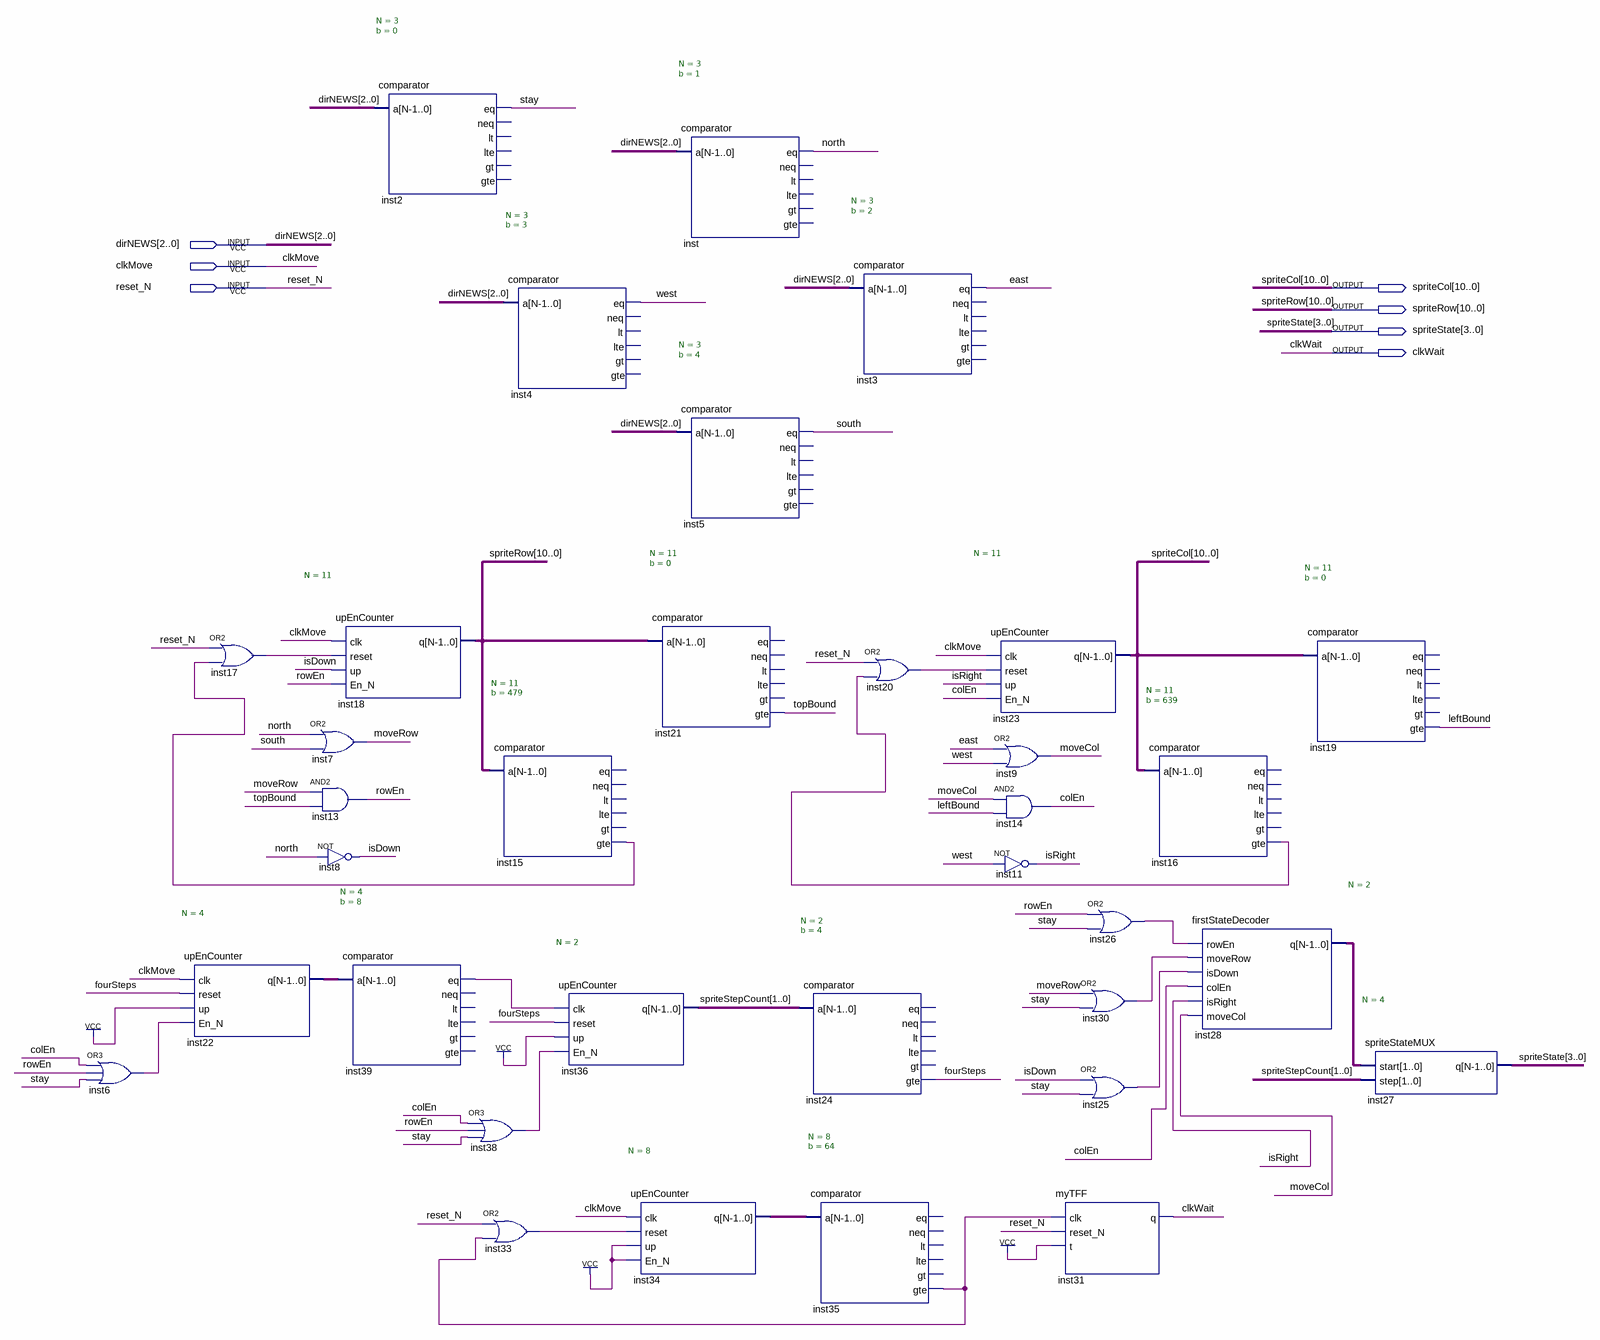
[diagram p0: schematic sheet]
// Quartus schematic spritePositionModule.bdf as structural Verilog: 34 symbols, 7 pins
module spritePositionModule (
  input  [2:0] dirNEWS,
  input  clkMove,
  input  reset_N,
  output [10:0] spriteCol,
  output [10:0] spriteRow,
  output [3:0] spriteState,
  output clkWait
);

  wire colEn, east, fourSteps, inst6_out, inst15_gte, inst16_gte, inst17_out, inst20_out, inst25_out,
       inst26_out, inst30_out, inst33_out, inst35_gte, inst38_out, inst39_eq, isDown, isRight, leftBound,
       moveCol, moveRow, north, rowEn, south, stay, topBound, west;
  wire [1:0] inst28_q, spriteStepCount;
  wire [3:0] inst22_q;
  wire [7:0] inst34_q;

  or inst6 (inst6_out, colEn, rowEn, stay);
  upEnCounter #(.N(4)) inst22 (.clk(clkMove), .reset(fourSteps), .up(1'b1), .En_N(inst6_out), .q(inst22_q));
  or inst17 (inst17_out, reset_N, inst15_gte);
  upEnCounter #(.N(11)) inst18 (.clk(clkMove), .reset(inst17_out), .up(isDown), .En_N(rowEn), .q(spriteRow));
  or inst7 (moveRow, north, south);
  and inst13 (rowEn, moveRow, topBound);
  not inst8 (isDown, north);
  comparator #(.N(4), .b(8)) inst39 (.a(inst22_q), .eq(inst39_eq));  // open: neq, lt, lte, gt, gte
  comparator #(.N(3), .b(0)) inst2 (.a(dirNEWS), .eq(stay));  // open: neq, lt, lte, gt, gte
  or inst38 (inst38_out, colEn, rowEn, stay);
  comparator #(.N(3), .b(3)) inst4 (.a(dirNEWS), .eq(west));  // open: neq, lt, lte, gt, gte
  comparator #(.N(11), .b(479)) inst15 (.a(spriteRow), .gte(inst15_gte));  // open: eq, neq, lt, lte, gt
  or inst33 (inst33_out, reset_N, inst35_gte);
  upEnCounter #(.N(2)) inst36 (.clk(inst39_eq), .reset(fourSteps), .up(1'b1), .En_N(inst38_out), .q(spriteStepCount));
  comparator #(.N(11), .b(0)) inst21 (.a(spriteRow), .gte(topBound));  // open: eq, neq, lt, lte, gt
  upEnCounter #(.N(8)) inst34 (.clk(clkMove), .reset(inst33_out), .up(1'b1), .En_N(1'b1), .q(inst34_q));
  comparator #(.N(3), .b(1)) inst (.a(dirNEWS), .eq(north));  // open: neq, lt, lte, gt, gte
  comparator #(.N(3), .b(4)) inst5 (.a(dirNEWS), .eq(south));  // open: neq, lt, lte, gt, gte
  comparator #(.N(2), .b(4)) inst24 (.a(spriteStepCount), .gte(fourSteps));  // open: eq, neq, lt, lte, gt
  comparator #(.N(8), .b(64)) inst35 (.a(inst34_q), .gte(inst35_gte));  // open: eq, neq, lt, lte, gt
  comparator #(.N(3), .b(2)) inst3 (.a(dirNEWS), .eq(east));  // open: neq, lt, lte, gt, gte
  or inst20 (inst20_out, reset_N, inst16_gte);
  upEnCounter #(.N(11)) inst23 (.clk(clkMove), .reset(inst20_out), .up(isRight), .En_N(colEn), .q(spriteCol));
  or inst9 (moveCol, east, west);
  and inst14 (colEn, moveCol, leftBound);
  not inst11 (isRight, west);
  myTFF inst31 (.clk(inst35_gte), .reset_N(reset_N), .t(1'b1), .q(clkWait));
  or inst26 (inst26_out, rowEn, stay);
  or inst30 (inst30_out, moveRow, stay);
  or inst25 (inst25_out, isDown, stay);
  comparator #(.N(11), .b(639)) inst16 (.a(spriteCol), .gte(inst16_gte));  // open: eq, neq, lt, lte, gt
  firstStateDecoder #(.N(2)) inst28 (
    .rowEn(inst26_out), .moveRow(inst30_out), .isDown(inst25_out), .colEn(colEn), .isRight(isRight),
    .moveCol(moveCol), .q(inst28_q));
  comparator #(.N(11), .b(0)) inst19 (.a(spriteCol), .gte(leftBound));  // open: eq, neq, lt, lte, gt
  spriteStateMUX #(.N(4)) inst27 (.start(inst28_q), .step(spriteStepCount), .q(spriteState));
endmodule
